# Altium schematic sheet Sheet1.SchDoc
size A; SheetNumber: 1; SheetTotal: 1; SPICEModelCacheKHDSUYUS: <root> / <DocumentId>KHDSUYUS</DocumentId> / </root>
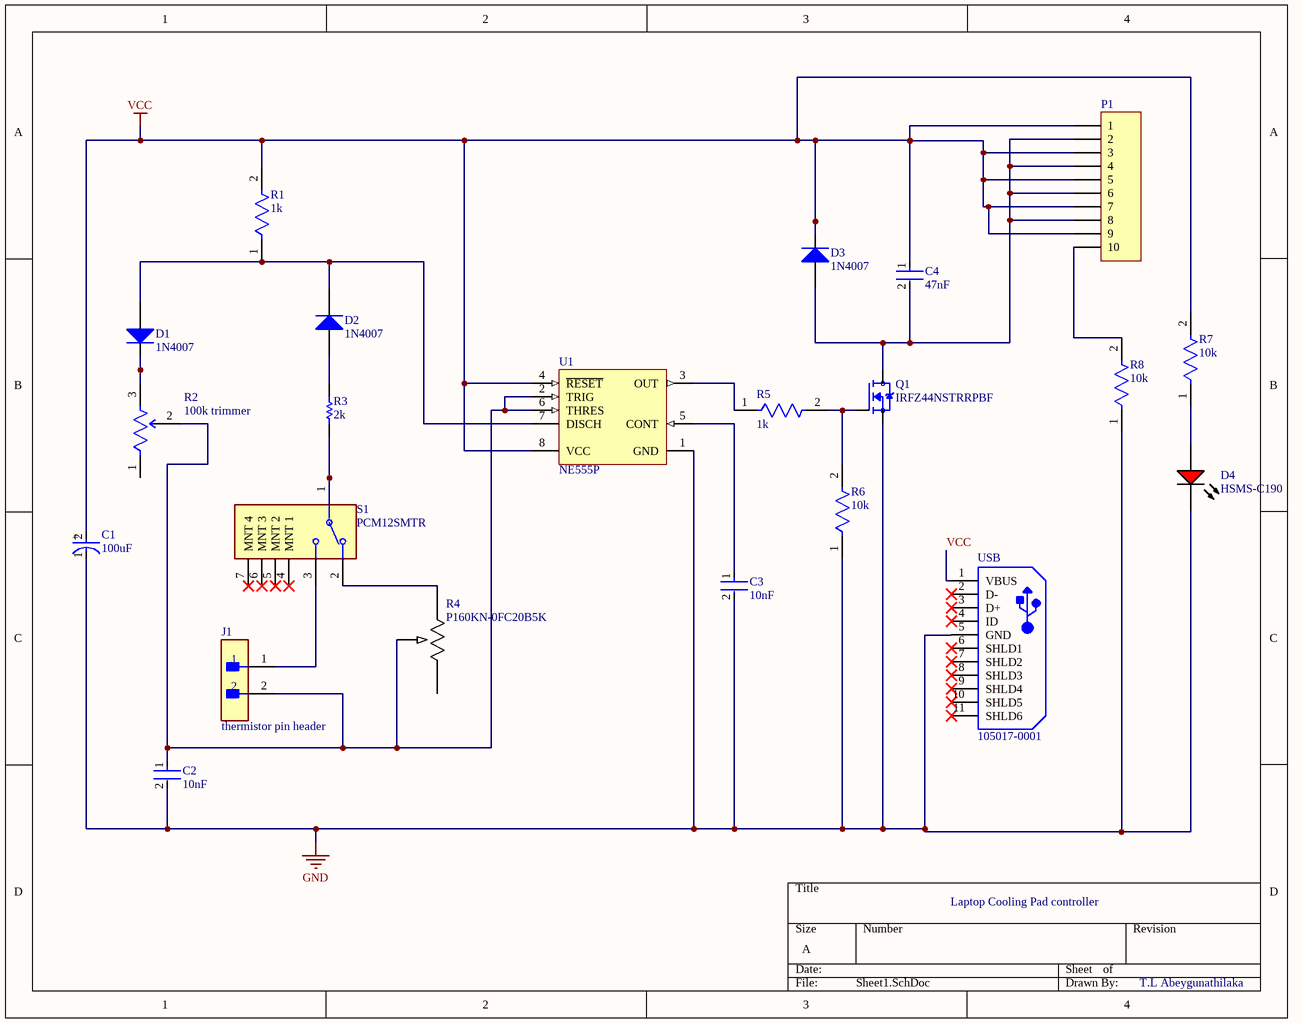
[diagram p0: Sheet1.SchDoc]

## Parts
C1  100uF  [FP-TAJW-MFG]
C2  10nF  [FP-0805-L_2_01_0_2-W_1_25-IPC_B]
C3  10nF  [FP-0805-L_2_01_0_2-W_1_25-IPC_B]
C4  47nF  [FP-VY2472M49Y5UG63V7-MFG]
D1  1N4007  [My_DO41]
D2  1N4007  [My_DO41]
D3  1N4007  [My_DO41]
D4  HSMS-C190  [AVAG-HSMX-C190_V]
J1  thermistor pin header  [FP-M22-2510205-MFG]
P1  Header 10  [MY_MA10-1]  (value not drawn)
Q1  IRFZ44NSTRRPBF  [DPAK254P1524X483-3N]
R1  1k  [FP-RP732B-MFG]
R2  100k trimmer  [FP-3296W-MFG]
R3  2k  [RESC2013X60X35LL10T20]
R4  P160KN-0FC20B5K  [POT_P160KN_F20_TTE]
R5  1k  [FP-RC2012-MFG]
R6  10k  [FP-RMCF0805-IPC_A]
R7  10k  [FP-RMCF0805-IPC_A]
R8  10k  [FP-RMCF0805-IPC_A]
S1  PCM12SMTR  [FP-PCM12SMTR-MFG]
U1  NE555P  [P0008A]
USB  105017-0001  [USB-MICRO-B_V]

## Nets
GND: C1.1(C) C2.2 C3.2 D4.2(K) Q1.3(S) R6.1 R8.1 U1.1(GND) USB.5(GND)
VCC: C1.2(A) C4.1 D3.K P1.1 P1.3 P1.5 P1.7 P1.9 R1.2 R7.2 U1.4(~{RESET}) U1.8(VCC) USB.1(VBUS)
NetC2_1: C2.1 J1.2 R2.2(WIPER) R4.2 U1.2(TRIG) U1.6(THRES)
NetC3_1: C3.1 U1.5(CONT)
NetC4_2: C4.2 D3.A P1.2 P1.4 P1.6 P1.8 Q1.2(D)
NetD1_A: D1.A D2.K R1.1 U1.7(DISCH)
NetD1_K: D1.K R2.3(CW)
NetD2_A: D2.A R3.2
NetD4_1: D4.1(A) R7.1
NetJ1_1: J1.1 S1.3
NetP1_10: P1.10 R8.2
NetQ1_1: Q1.1(G) R5.2 R6.2
NetR3_1: R3.1 S1.1
NetR4_3: R4.3 S1.2
NetR5_1: R5.1 U1.3(OUT)

Not connected (* = marked no-connect by the designer): R2 1(CCW); R4 1; S1 4(MNT_1)* 5(MNT_2)* 6(MNT_3)* 7(MNT_4)*; USB 2(D-)* 3(D+)* 4(ID)* 6(SHLD1)* 7(SHLD2)* 8(SHLD3)* 9(SHLD4)* 10(SHLD5)* 11(SHLD6)*

## Notes on the sheet
- Laptop Cooling Pad controller
- T.L Abeygunathilaka
- (in symbol CMP-04424-000114-1) +

## Library data of the parts
C1 = CMP-04424-000114-1: 100uF 4V  ±10% 400mΩ 2312  SMD Tantalum Capacitor; Dissipation Factor: 6%; Polarity: Polar; Leakage Current: 4uA; ESR (Equivalent Series Resistance): 1.3R; Packaging: Tape and Reel; Height: 1.5mm; Case Code (Metric): 6032; Width: 0.126inch; Termination: SMD/SMT; Voltage Rating: 4V; Height - Seated (Max): 0.059inch; Case/Package: Molded; Mount: Surface Mount; Lead Free: Lead Free; Features: General Purpose; Tolerance: 10%; Construction: Flat; REACH SVHC: No SVHC; Voltage Rating (DC): 4V; Number of Pins: 2; Max Operating Temperature: 125°C; Case Code (Imperial): 2412; Dielectric Material: Tantalum; Package Quantity: 1000; RoHS Compliant: Yes; Series: TAJ; Radiation Hardening: No; Capacitance: 100uF; Length: 6mm; Min Operating Temperature: -55°C; Depth: 3.2mm
C2 C3 = CMP-2007-04361-2: General Purpose Ceramic Capacitor, 0805, 10nF, 5%, X7R, 0.15, 50V; Insulation Resistance: 100GR; Dissipation Factor: 2.5%; Series: -; Case Code (Imperial): 0805; Voltage Rating (DC): 50V; Dielectric: X7R; Voltage Rating: 50V; Lead Free: Lead Free; Max Operating Temperature: 125°C; Depth: 1.25mm; Termination: SMD/SMT; Number of Pins: 2; Dielectric Material: Ceramic; Capacitance: 10nF; Case/Package: 0805; Contact Plating: Tin; Mount: Surface Mount; Height: 0.71mm; Package Quantity: 1; Packaging: Tape and Reel; Construction: Flat; RoHS Compliant: Yes; Voltage: 50V; Case Code (Metric): 2012; REACH SVHC: No SVHC; Tolerance: 5%; Radiation Hardening: No; Width: 0.049inch; Thickness: 0.037inch; Length: 2.01mm; Min Operating Temperature: -55°C
C4 = CMP-02417-000047-1: Capacitor Ceramic 4700pF ±20% Y5U BULK RADIAL; Lead/Base Style: Kinked; Capacitance: 4.7nF; Voltage Rating (DC): 300V; Body Diameter: 12.5mm; Lead Diameter: 0.6mm; Dissipation Factor: 2.5%; Mount: Through Hole; Package Quantity: 1000; Packaging: Bulk; Case/Package: Radial; Resistor Type: Ceramic; Termination: Radial; Series: VY2; Dielectric: Y5U; RoHS Compliant: Yes; Weight: 0.040932oz; Height - Seated (Max): 0.65inch; Tolerance: 20%; Lead Pitch: 7.5mm; REACH SVHC: No SVHC; Voltage Rating: 300V; Thickness: 5mm; Diameter: 12.5mm; Voltage Rating (AC): 300V; Max Operating Temperature: 125°C; Min Operating Temperature: -40°C
D1-D3 = 1N4007: 1 Amp Diode; ASiD Part Number: 1n4007-AS
D4 = CMP-2000-06427-1: LED Uni-Color Red, 52 mW, 20 mA, -40 to 85 degC, 2-Pin SMD, RoHS, Tape and Reel; Manufacturer: Avago; Reverse Voltage: 5V; Viewing Angle: 170deg; High Brightness: No; Lens Type: ColorlessDiffused; DELETED: Compliant; Product Height (mm): 0.8mm; Dominant Wave Length: 626nm; Number of  Elements: 1; Chip Material: GaP; Lum Intensity: 10mcd; Product Length (mm): 1.6mm; Forward Voltage: 2.6V; Power Dissipation: 52W; Shape Type: Rectangular; Forward Current: 25mA; Peak Wavelength: 630nm; Test Current (It): 20mA; Main Category: ChipLED; Lens Dimensions: 1x0.8x0.5mm; Pin Count: 2; Package Reference: HSMX-C190; Mounting Technology: SurfaceMount; Mounting: SurfaceMount; Datasheet URL: http://docs.avagotech.com/docs/AV02-0551EN; Package Type: ChipLed; Operating Temperature Classification: Industrial; Datasheet Version: 03/2012; Operating Temp Range: -40Cto85C; Emitting Color: Red; Rad Hardened: No; Manufacturer URL: http://www.avagotech.com/; Luminous Intensity: 10mcd; Package Description: 2-Pin Surface Mount Device, Body 1.6 x 0.8 mm, Height 0.9 mm; Type: Uni-Color; Packaging: TapeandReel; Product Depth (mm): 0.8mm
J1 = CMP-15831-000005-1: CONN HEADER VERT 2POS 2MM; Manufacturer: Harwin; Manufacturer Part Number: M22-2510205; Conn Gender: Male; Current Rating: 2A; Number Of Contacts: 2; Conn Orientation: Vertical; Temperature Range Low: -40°C; Device Class L1: Connectors; ComponentLink2URL: https://cdn.harwin.com/pdfs/C018XX_M22_Series_Connectors.pdf; Temperature Range High: +105°C; Pitch: 2mm; Number Of Rows: 1; Temperature: -40°C to +105°C; Automotive: No; Device Class L3: unset; Octopart: https://octopart.com/m22-2510205-harwin-2538221; Mouser Description: Headers & Wire Housings 2 PIN SIL VERTICAL GOLD PIN HEADER; Height: 5.45mm; Category: Conn; Digikey Description: CONN HEADER VERT 2POS 2MM; Contact Material: Gold,Nickel; Lead Free: Yes; ComponentLink2Description: Datasheet; Device Class L2: Headers and Wire Housings; Package: 0; Footprint Url: https://cdn.harwin.com/pdfs/M22-251.pdf; RoHS: TRUE
P1 = Header 10: Header, 10-Pin; ASiD Part Number: Header 10-AS
Q1 = IRFZ44NSTRRPBF: RoHS Compliant | Low RDS(on) | Industry-leading quality | Dynamic dv/dt Rating | Fast Switching | Fully Avalanche Rated | 175C Operating Temperature; MF: Infineon Technologies; Value: *; SnapEDA_Link: https://www.snapeda.com/parts/IRFZ44NSTRRPBF/Infineon+Technologies/view-part/?ref=snap; Availability: In Stock; Price: None; Check_prices: https://www.snapeda.com/parts/IRFZ44NSTRRPBF/Infineon+Technologies/view-part/?ref=eda; Purchase-URL: https://pricing.snapeda.com/search/part/IRFZ44NSTRRPBF/?ref=eda; Package: D2PAK Infineon; MP: IRFZ44NSTRRPBF
R1 = CMP-03211-008960-1: Res Thin Film 1206 1.0KΩ 0.1% 0.25W 15ppm/°C Molded SMD; Manufacturer: TE Connectivity; Manufacturer Part Number: RP73D2B1K0BTG; Voltage Rating: 200V; Octopart: https://octopart.com/rp73d2b1k0btg-te+connectivity-42012461; Ipc Land Pattern Name: RESC305155X55; ComponentLink2Description: Datasheet; Temperature Range High: 155°C; Series: RP73; Device Class L3: Chip SMD Resistors; Resistance: 1.0KΩ; Value: 1.0KΩ; Device Class L2: Resistors; Temperature Coefficient: 15ppm/°C; Temperature Range Low: -55°C; Device Class L1: Passive Components; Height: 0.65mm; Automotive: No; Package: RP732B; RoHS: TRUE; Tolerance: 0.1%; octopart_url: https://octopart.com/rp73d2b1k0btg-te+connectivity-42012461; packaging: 250 cut tape length; Temperature: -55°C to 155°C; Power Rating: 0.25W; Category: Res; Lead Free: Yes; ComponentLink2URL: https://www.te.com/commerce/DocumentDelivery/DDEController?Action=showdoc&DocId=Data+Sheet%7F1773272%7FL%7Fpdf%7FEnglish%7FENG_DS_1773272_L.pdf%7F8-1879255-6; Composition: Thin Film
R2 = CMP-07234-000043-1: TRIMMER 50K OHM 0.5W PC PIN TOP; Manufacturer Series: 3296; Resistance Tolerance: 10%; Actuator Orientation: Vertical; Resistance: 50kR; Number of Turns: 25; Power Rating: 500mW; Insulation Resistance: 1GR; Actuator Type: SCREW; Resistance Law: Linear; Number of Terminals/Pins: 3; Temperature Coefficient: 100ppm/°C; Weight: 0.03oz; Length: 9.53mm; Package Quantity: 50; Resistor Type: Cermet; Min Operating Temperature: -55°C; Termination: Pin; Radiation Hardening: No; Terminal Finish: Tin; Height: 0.395inch; Depth: 4.83mm; REACH SVHC: No SVHC; Width: 9.53mm; Packaging: Rail/Tube; RoHS Compliant: Yes; Mount: Panel; Max Power Dissipation: 500mW; Taper: Linear; Color: Blue; Technology: CERMET; Lead Free: Lead Free; Max Operating Temperature: 125°C; Number of Pins: 3; Type: Potentiometer; Military Standard: Not; Contact Plating: Tin; Series: 3296; Tolerance: 10%
R3 = CMP-2001-01475-1: Part Number: RT0805FRE072KL; Manufacturer: Yageo
R4 = P160KN-0FC20B5K: No Description Available; Mfr_Name: TT Electronics
R5 = CMP-13261-003265-1: Res Thick Film 0805 1kΩ 1% 0.125W ±100ppm/°C Molded SMD T/R; Max Power Dissipation: 125mW; Resistance: 1kR; Voltage Rating (DC): 150V; Height: 0.024inch; Military Standard: Not; Min Operating Temperature: -55°C; Composition: Thick Film; Case Code (Metric): 2012; Lead Free: Lead Free; Contact Plating: Tin; Max Operating Temperature: 155°C; Case/Package: 0805; Case Code (Imperial): 0805; Radiation Hardening: No; Width: 0.049inch; Number of Terminations: 2; Tolerance: 1%; Features: Moisture Resistant; Packaging: Tape and Reel; Temperature Coefficient: 100ppm/°C; Length: 0.079inch; Depth: 1.25mm
R6-R8 = CMP-26527-002663-1: 10kΩ ±5% 0.125W 0805 Thick Film Chip Resistor AEC-Q200 compliant; Resistance: 10kR; Max Power Dissipation: 125mW; Temperature Coefficient: 100ppm/°C; Construction: Rectangular; RoHS Compliant: Yes; Resistor Type: Thick Film; Series: RMCF; Features: Automotive AEC-Q200; Case Code (Imperial): 0805; Mount: Surface Mount; Min Operating Temperature: -55°C; Military Standard: Not; Tolerance: 5%; Size Code: 0805; Contact Plating: Tin; Length: 2mm; Depth: 1.25mm; Case Code (Metric): 2012; Packaging: Tape and Reel; Radiation Hardening: No; Height: 0.026inch; Case/Package: 0805; Width: 0.049inch; Lead Free: Lead Free; Max Operating Temperature: 155°C; Number of Terminations: 2; Power Rating: 125mW
S1 = CMP-2000-06884-2: SWITCH SLIDE SPDT 300MA 6V; Actuator Material: Nylon; Switch Function: On-On; Insulation Resistance: 100mR; Actuator Type: Standard; Mechanical Life: 10000Cycles; Actuator Length: 1.5mm; Contact Resistance: 70mR; Min Operating Temperature: -20°C; Max Current Rating: 300mA; Max Voltage Rating (DC): 6V; Package Quantity: 1; Mount: Surface Mount; Packaging: Tape and Reel; Contact Plating: Silver; Depth: 5mm; REACH SVHC: No SVHC; Voltage Rating (DC): 6V; Voltage Rating (AC): 6V; Max Operating Temperature: 85°C; Length: 7.7mm; Termination: Gull Wing; Current Rating: 300mA; Contact Current Rating: 300mA; Orientation: Right Angle; Width: 6.7mm; Switch Travel: 1.5mm; Lead Free: Lead Free; Contact Material: Copper Alloy; Throw Configuration: SPDT
U1 = CMP-2000-04954-1: Precision Timer, 4.5 to 16 V, 0 to 70 degC, 8-Pin DIP, Pb-Free, Tube; Manufacturer: TexasInstruments; Maximum High Level Output Current: -200mA; Number of Internal Timers: 1; Operating Supply Voltage: 5; Maximum Low Level Output Current: 200mA; Rad Hard: No; Packaging: Rail/Tube; Manufacturer URL: http://www.ti.com/; Package Reference: P8; Package Description: 8-Pin Double In-line Package, Body 9.59 x 6.35 mm, Pitch 2.54 mm; Package URL: http://www.ti.com/lit/ml/mpdi001b/mpdi001b.pdf; Type: Standard; Datasheet URL: http://www.ti.com/general/docs/lit/getliterature.tsp?genericPartNumber=NE555&fileType=pdf; Category: Timer; Package: 8PDIP; Datasheet Version: Rev. I, 09/2014
USB = CMP-2000-05827-1: Micro-USB B Receptacle, Right Angle, Bottom Mount, Surface Mount, with Solder Tabs, -30 to 85 degC, 5-Pin USB, RoHS, Tape and Reel; Manufacturer: Molex; Featured Product: Micro-USBConnectorsUSBConnectors; Other Names: WM1399DKR; Package Version: Rev. F, 12/2012; Number of Contacts: 5; Connector Type: USB-microB; Catalog Drawings: 1050170001; 3D Model: 105017-0001.stp; Mating Products: WM17145-ND-CABLEMICROUSBBTOSTDA1.0MWM17147-ND-CABLEMICROUSBBTOSTDA2.0MWM17146-ND-CABLEMICROUSBBTOSTDA1.5M; PCN Assembly/Origin: ResinSupplier21/Oct/2015; Voltage - Max: 30V; Online Catalog: Molex-MicroUSB; Manufacturer URL: http://www.molex.com/; Package Description: 5-Leads USB, Micro B, Body 7.5 x 5 mm, Pitch 0.65 mm; Datasheet URL: http://www.molex.com/elqNow/elqRedir.htm?ref=http://www.molex.com/webdocs/datasheets/pdf/en-us/1050170001_IO_CONNECTORS.pdf; Ingress Protection: -; Datasheet Version: 03/2016; Mounting Type: BoardCutout,SurfaceMount,RightAngle; Circuits: 5; Standard Package: 1; Package Reference: MICRO-B; Package URL: http://www.molex.com/pdm_docs/sd/1050170001_sd.pdf; Category: Connectors,Interconnects; Series: -; RoHS Information: 1050170001CertofCompliance; Features: Shielded,SolderRetention; Family: USB,DVI,HDMIConnectors; Specifications: -; Gender: Receptacle; Packaging: Digi-Reel®; Mounting Technology: SurfaceMount